# Altium schematic sheet 2015-05-17_04-35-201.schdoc
size 212 x 154 mm; SheetNumber: 1; SheetTotal: 1
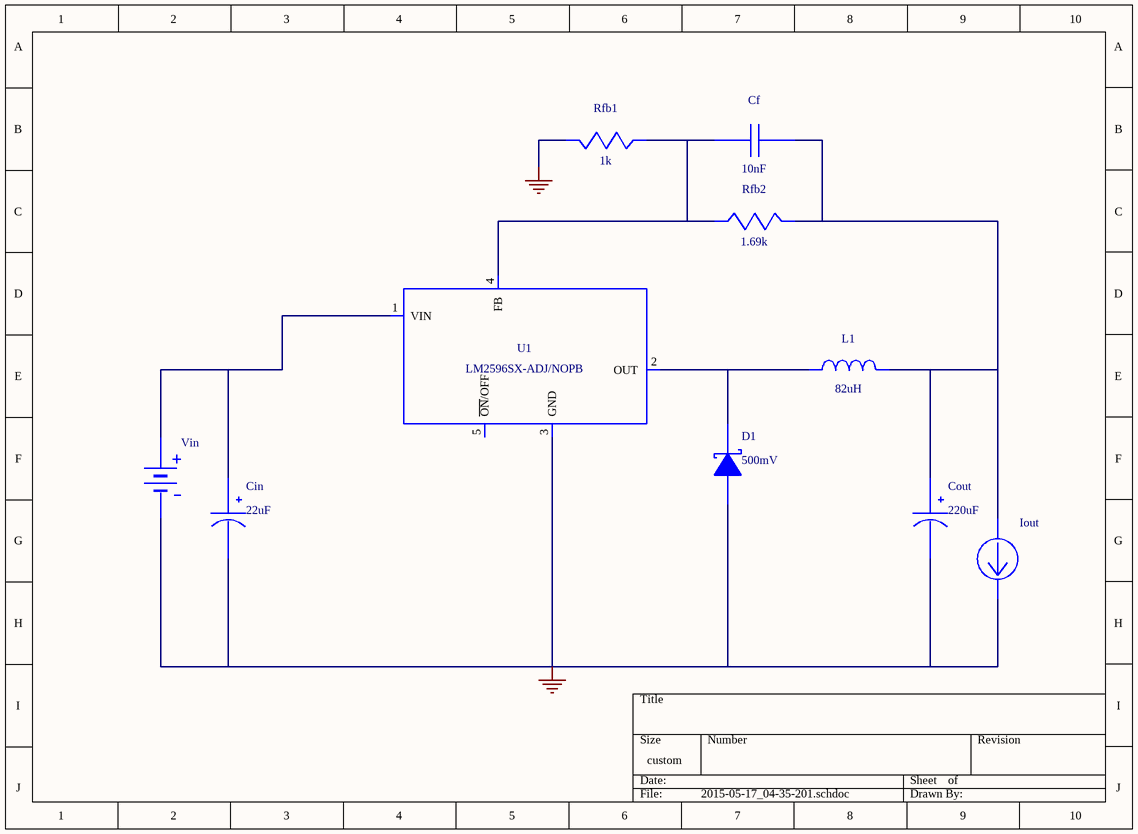
[diagram p0: 2015-05-17_04-35-201.schdoc]

## Parts
Cf  value 10nF  (hidden comment: GRM216R71H103KA01D)
Cin  value 22uF  (hidden comment: 35SVPF22M)
Cout  value 220uF  (hidden comment: 6TPE220MAZB)
D1  value 500mV  (hidden comment: B230A-13-F)
Iout  WB_CURRENT_LOAD  (value not drawn)
L1  value 82uH  (hidden comment: SDR1307-820KL)
Rfb1  value 1k  (hidden comment: CRCW04021K00FKED)
Rfb2  value 1.69k  (hidden comment: CRCW04021K69FKED)
U1  LM2596SX-ADJ/NOPB
Vin  WB_BATTERY  (value not drawn)

## Nets
0: Cin.2(-) Cout.2(-) D1.2(A) Iout.2(-) Rfb1.1 U1.3(GND) U1.6(TAB) Vin.2(-)
NetCf_1: Cf.1 Cout.1(+) Iout.1(+) L1.2 Rfb2.1
NetCf_2: Cf.2 Rfb1.2 Rfb2.2 U1.4(FB)
NetCin_1: Cin.1(+) U1.1(VIN) Vin.1(+)
NetD1_1: D1.1(K) L1.1 U1.2(OUT)

Not connected (* = marked no-connect by the designer): U1 5(~{ON}/OFF)

## Library data of the parts
Cf = GRM216R71H103KA01D: GRM216R71H103KA0; Manufacturer Name: MuRata; PackageReference: GRM216R71H103KA01D; Manufacturer Part Number: GRM216R71H103KA01D
Cin = 35SVPF22M: Manufacturer Name: Panasonic; PackageReference: 35SVPF22M; Manufacturer Part Number: 35SVPF22M
Cout = 6TPE220MAZB: Manufacturer Name: Panasonic; PackageReference: 6TPE220MAZB; Manufacturer Part Number: 6TPE220MAZB
D1 = B230A-13-F: Manufacturer Name: Diodes Inc.; PackageReference: B230A-13-F; Manufacturer Part Number: B230A-13-F
Iout = WB_CURRENT_LOAD: Value: UNLISTED; PackageReference: WB_CURRENT_LOAD; Manufacturer Part Number: WB_CURRENT_LOAD; Manufacturer Name: WB_CURRENT_LOAD
L1 = SDR1307-820KL: Manufacturer Name: Bourns; PackageReference: SDR1307-820KL; Manufacturer Part Number: SDR1307-820KL
Rfb1 = CRCW04021K00FKED: Manufacturer Name: Vishay-Dale; PackageReference: CRCW04021K00FKED; Manufacturer Part Number: CRCW04021K00FKED
Rfb2 = CRCW04021K69FKED: Manufacturer Name: Vishay-Dale; PackageReference: CRCW04021K69FKED; Manufacturer Part Number: CRCW04021K69FKED
U1 = LM2596SX-ADJ/NOPB: LM2596SX-ADJ/NOP; Manufacturer Name: Texas Instruments; Value: UNLISTED; PackageReference: LM2596SX-ADJ/NOPB; Manufacturer Part Number: LM2596SX-ADJ/NOPB
Vin = WB_BATTERY: Value: UNLISTED; PackageReference: WB_BATTERY; Manufacturer Part Number: WB_BATTERY; Manufacturer Name: WB_BATTERY